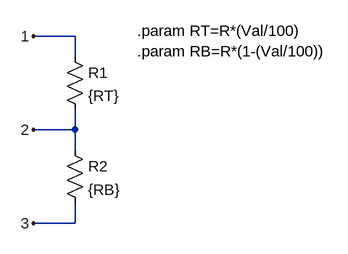
[diagram p0: schematic potentiometer.asc]
potentiometer.asc, the LTspice schematic file:
Version 4
SHEET 1 880 680
WIRE 128 32 64 32
WIRE 128 64 128 32
WIRE 128 176 128 144
WIRE 128 176 64 176
WIRE 128 208 128 176
WIRE 128 320 128 288
WIRE 128 320 64 320
FLAG 64 32 1
FLAG 64 176 2
FLAG 64 320 3
SYMBOL res 112 48 R0
SYMATTR InstName R1
SYMATTR Value {RT}
SYMBOL res 112 192 R0
SYMATTR InstName R2
SYMATTR Value {RB}
TEXT 224 24 Left 2 !.param RT=R*(Val/100)\n.param RB=R*(1-(Val/100))

The netlist it stands for:
* potentiometer.asc
R1 1 2 {RT}
R2 2 3 {RB}
.param RT=R*(Val/100)
.param RB=R*(1-(Val/100))
.backanno
.end